# Altium schematic sheet ETH_PHY_RGMII.SchDoc: Sayma AMC
size 420 x 297 mm; $$Internal___BlkDate: 0:12:25_2-9-18; $$Internal_NAME_PLACEHOLDER: a3sheet; $$Internal_Resolution: 00001mm; $$NotCommonProperty_@NAME: ETH_PHY_RMII_MII; $$NotCommonProperty_@PRINTORDER: 6; $$NotCommonProperty_@SHEET: 1; $$NotCommonProperty_@SHEETTOTAL: 30; CmpIndex: 106; Drawing Author: G.Kasprowicz; Drawing Number: Sayma AMC; Drawing Project: AMC FMC Carrier Board; Drawing Revision: 2.0; SymIndex: 2141; CheckedBy: P.Kulik,T.Przywozki,W.Ruclo; Author: G.Kasprowicz; CompanyName: WUT ISE; DrawnBy: G.Kasprowicz; Organization: WUT ISE; Address1: PW ISE; Address2: Nowowiejska 15/19 00-665 Warsaw; Address3: gkasprow@gmail.com; DocumentNumber: 8; Revision: 2; SheetNumber: 8; SheetTotal: 32; ModifiedBy: -; CheckedDate: -; Title2: Ethernet PHY; DivGrp: WUT ISE; Designer: G.Kasprowicz; ModifiedDate: -; ProjectName: Sensor Box
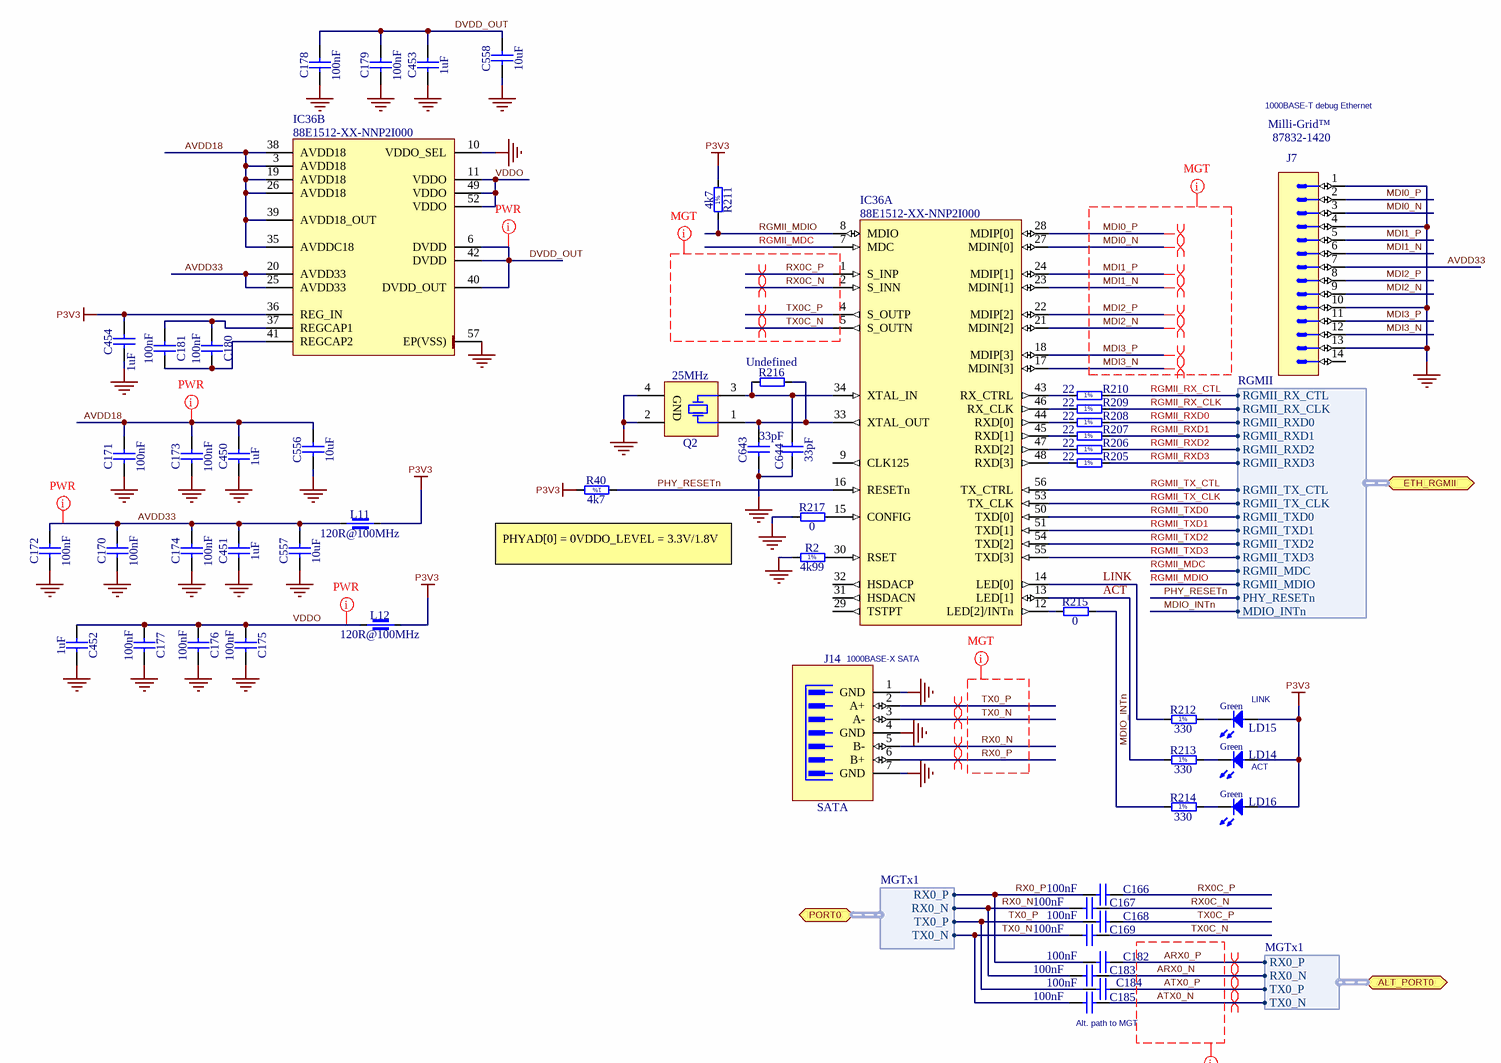
[diagram p0: ETH_PHY_RGMII.SchDoc]

## Parts
C166  100nF  [CAPC0603X33N]
C167  100nF  [CAPC0603X33N]
C168  100nF  [CAPC0603X33N]
C169  100nF  [CAPC0603X33N]
C170  100nF  [CAPC0603X33N]
C171  100nF  [CAPC0603X33N]
C172  100nF  [CAPC0603X33N]
C173  100nF  [CAPC0603X33N]
C174  100nF  [CAPC0603X33N]
C175  100nF  [CAPC0603X33N]
C176  100nF  [CAPC0603X33N]
C177  100nF  [CAPC0603X33N]
C178  100nF  [CAPC0603X33N]
C179  100nF  [CAPC0603X33N]
C180  100nF  [CAPC0603X33N]
C181  100nF  [CAPC0603X33N]
C182  100nF  [CAPC0603X33N]
C183  100nF  [CAPC0603X33N]
C184  100nF  [CAPC0603X33N]
C185  100nF  [CAPC0603X33N]
C450  1uF  [CAPC1005X55N]
C451  1uF  [CAPC1005X55N]
C452  1uF  [CAPC1005X55N]
C453  1uF  [CAPC1005X55N]
C454  1uF  [CAPC1005X55N]
C556  10uF  [CAPC1608X87N]
C557  10uF  [CAPC1608X87N]
C558  10uF  [CAPC1608X87N]
C643  33pF  [CAPC1005X55N]
C644  33pF  [CAPC1005X55N]
IC36  88E1512-XX-NNP2I000  [QFN50P800X800X100-57N-S437]  (parts A,B of 2)
J7  Milli-Grid™  Manufacturer Part Number: 87832-1420  [MOLEX_87832-1420]
J14  SATA  [MOLEX_67800-5005]
L11  120R@100MHz  [INDC1005X55N]
L12  120R@100MHz  [INDC1005X55N]
LD14  Green  [LED_AVAGO_HSME-C120]
LD15  Green  [LED_AVAGO_HSME-C120]
LD16  Green  [LED_AVAGO_HSME-C120]
Q2  25MHz  [XTAL_TXC_8Y]
R2  4k99  [RESC1608X55N]
R40  4k7  [RESC1005X40N]
R205  22  [RESC1005X40N]
R206  22  [RESC1005X40N]
R207  22  [RESC1005X40N]
R208  22  [RESC1005X40N]
R209  22  [RESC1005X40N]
R210  22  [RESC1005X40N]
R211  4k7  [RESC1005X40N]
R212  330  [RESC1005X40N]
R213  330  [RESC1005X40N]
R214  330  [RESC1005X40N]
R215  0  [RESC1005X40N]
R216  Undefined  [RESC1005X40N]
R217  0  [RESC1005X40N]

## Ports
ALT_PORT0 (bidir, harness MGTx1), ETH_RGMII (bidir, harness RGMII), PORT0 (bidir, harness MGTx1)

## Harnesses
MGTx1: RX0_P, RX0_N, TX0_P, TX0_N
RGMII: RGMII_RX_CTL, RGMII_RX_CLK, RGMII_RXD0, RGMII_RXD1, RGMII_RXD2, RGMII_RXD3, RGMII_TX_CTL, RGMII_TX_CLK, RGMII_TXD0, RGMII_TXD1, RGMII_TXD2, RGMII_TXD3, RGMII_MDC, RGMII_MDIO, PHY_RESETn, MDIO_INTn

## Nets
GND: C170.1 C171.1 C172.1 C173.1 C174.1 C175.1 C176.1 C177.1 C178.1 C179.1 C450.1 C451.1 C452.1 C453.1 C454.1 C556.1 C557.1 C558.1 C643.1 C644.1 IC36.10(VDDO_SEL) IC36.57(EP(VSS)) J7.1 J7.4 J7.10 J7.13 J14.1(GND) J14.4(GND) J14.7(GND) Q2.2(GND) Q2.4(GND) R2.1 R217.1
P3V3: C454.2 IC36.36(REG_IN) L11.2 L12.1 LD14.2(A) LD15.2(A) LD16.2(A) R40.2 R211.2
ACT: IC36.13(LED[1]) R213.1
ARX0_N: C183.2 ; port ALT_PORT0.RX0_N
ARX0_P: C182.2 ; port ALT_PORT0.RX0_P
ATX0_N: C185.2 ; port ALT_PORT0.TX0_N
ATX0_P: C184.2 ; port ALT_PORT0.TX0_P
AVDD18: C171.2 C173.2 C450.2 C556.2 IC36.3(AVDD18) IC36.19(AVDD18) IC36.26(AVDD18) IC36.35(AVDDC18) IC36.38(AVDD18) IC36.39(AVDD18_OUT)
AVDD33: C170.2 C172.2 C174.2 C451.2 C557.2 IC36.20(AVDD33) IC36.25(AVDD33) J7.7 L11.1
DVDD_OUT: C178.2 C179.2 C453.2 C558.2 IC36.6(DVDD) IC36.40(DVDD_OUT) IC36.42(DVDD)
LINK: IC36.14(LED[0]) R212.1
MDI0_N: IC36.27(MDIN[0]) J7.3
MDI0_P: IC36.28(MDIP[0]) J7.2
MDI1_N: IC36.23(MDIN[1]) J7.6
MDI1_P: IC36.24(MDIP[1]) J7.5
MDI2_N: IC36.21(MDIN[2]) J7.9
MDI2_P: IC36.22(MDIP[2]) J7.8
MDI3_N: IC36.17(MDIN[3]) J7.12
MDI3_P: IC36.18(MDIP[3]) J7.11
MDIO_INTn: R214.1 R215.2 ; port ETH_RGMII.MDIO_INTn
PHY_RESETn: IC36.16(RESETn) R40.1 ; port ETH_RGMII.PHY_RESETn
RGMII_MDC: IC36.7(MDC) ; port ETH_RGMII.RGMII_MDC
RGMII_MDIO: IC36.8(MDIO) R211.1 ; port ETH_RGMII.RGMII_MDIO
RGMII_RX_CLK: R209.2 ; port ETH_RGMII.RGMII_RX_CLK
RGMII_RX_CTL: R210.2 ; port ETH_RGMII.RGMII_RX_CTL
RGMII_RXD0: R208.2 ; port ETH_RGMII.RGMII_RXD0
RGMII_RXD1: R207.2 ; port ETH_RGMII.RGMII_RXD1
RGMII_RXD2: R206.2 ; port ETH_RGMII.RGMII_RXD2
RGMII_RXD3: R205.2 ; port ETH_RGMII.RGMII_RXD3
RGMII_TX_CLK: IC36.53(TX_CLK) ; port ETH_RGMII.RGMII_TX_CLK
RGMII_TX_CTL: IC36.56(TX_CTRL) ; port ETH_RGMII.RGMII_TX_CTL
RGMII_TXD0: IC36.50(TXD[0]) ; port ETH_RGMII.RGMII_TXD0
RGMII_TXD1: IC36.51(TXD[1]) ; port ETH_RGMII.RGMII_TXD1
RGMII_TXD2: IC36.54(TXD[2]) ; port ETH_RGMII.RGMII_TXD2
RGMII_TXD3: IC36.55(TXD[3]) ; port ETH_RGMII.RGMII_TXD3
RX0_N: C167.1 C183.1 J14.5(B-) ; port PORT0.RX0_N
RX0_P: C166.1 C182.1 J14.6(B+) ; port PORT0.RX0_P
RX0C_N: C167.2 IC36.2(S_INN)
RX0C_P: C166.2 IC36.1(S_INP)
TX0_N: C169.1 C185.1 J14.3(A-) ; port PORT0.TX0_N
TX0_P: C168.1 C184.1 J14.2(A+) ; port PORT0.TX0_P
TX0C_N: C169.2 IC36.5(S_OUTN)
TX0C_P: C168.2 IC36.4(S_OUTP)
VDDO: C175.2 C176.2 C177.2 C452.2 IC36.11(VDDO) IC36.49(VDDO) IC36.52(VDDO) L12.2
NetC180_1: C180.1 C181.1 IC36.41(REGCAP2)
NetC180_2: C180.2 C181.2 IC36.37(REGCAP1)
NetC643_2: C643.2 IC36.33(XTAL_OUT) Q2.1(X) R216.2
NetC644_2: C644.2 IC36.34(XTAL_IN) Q2.3(X) R216.1
NetIC36_12: IC36.12(LED[2]/INTn) R215.1
NetIC36_15: IC36.15(CONFIG) R217.2
NetIC36_30: IC36.30(RSET) R2.2
NetIC36_43: IC36.43(RX_CTRL) R210.1
NetIC36_44: IC36.44(RXD[0]) R208.1
NetIC36_45: IC36.45(RXD[1]) R207.1
NetIC36_46: IC36.46(RX_CLK) R209.1
NetIC36_47: IC36.47(RXD[2]) R206.1
NetIC36_48: IC36.48(RXD[3]) R205.1
NetLD14_1: LD14.1(C) R213.2
NetLD15_1: LD15.1(C) R212.2
NetLD16_1: LD16.1(C) R214.2

Not connected (* = marked no-connect by the designer): IC36 9(CLK125) 29(TSTPT) 31(HSDACN) 32(HSDACP); J7 14

## Layout directives
differential pair: ARX0_N, ARX0_P, ATX0_N, ATX0_P, MDI0_N, MDI0_P, MDI1_N, MDI1_P, MDI2_N, MDI2_P, MDI3_N, MDI3_P, RX0_N, RX0_P, RX0C_N, RX0C_P, TX0_N, TX0_P, TX0C_N, TX0C_P
net class PWR: AVDD18, AVDD33, DVDD_OUT, VDDO
net class MGT: ARX0_N, ARX0_P, ATX0_N, ATX0_P, MDI0_N, MDI0_P, MDI1_N, MDI1_P, MDI2_N, MDI2_P, MDI3_N, MDI3_P, RX0_N, RX0_P, RX0C_N, RX0C_P, TX0_N, TX0_P, TX0C_N, TX0C_P

## Notes on the sheet
- 1000BASE-T debug Ethernet
- (near R40) PHYAD[0] = 0VDDO_LEVEL = 3.3V/1.8V
- 1000BASE-X SATA
- (near LD15) LINK
- (near LD14) ACT
- (near C185) Alt. path to MGT
- Project/Equipment
- Document
- Designer
- Drawn by
- Check.by
- Copyright WUT ISE 2018.
  This documentation describes Open Hardware and is licensed under the CERN OHL v.1.1. You may redistribute and modify this documentation under the terms of the CERN OHL v.1.1. (http://ohwr.org/CERNOHL). This documentation is distributed WITHOUT ANY EXPRESS OR IMPLIED WARRANTY, INCLUDING OF MERCHANTABILITY, SATISFACTORY QUALITY AND FITNESS FOR A PARTICULAR PURPOSE. Please see the CERN OHL v.1.1 for applicable conditions.
- Contact
- File
- Last Mod.
- Print Date
- Sheet
- Size
- A3
- of
- Rev
- (in symbol R0402_4K7_1%_0.0625W_100PPM) 1%
- (in symbol R0402_22R_1%_0.0625W_100PPM) 1%
- (in symbol R0402_330R_1%_0.0625W_100PPM) 1%
- (in symbol R0603_4K99_1%_0.063W_50PPM) 1%

## Library data of the parts
C166-C185 = CC0201_100NF_6.3V_10%_X5R: Non-polarised capacitor; Manufacturer: GENERIC; Part Description: SMD Multilayer Chip Ceramic Capacitor; Manufacturer1 Part Number: 02016D104KAT2A; Tolerance: ±10%; Voltage: 6.3V; TC: X5R; Manufacturer Part Number: CC0201_100NF_6.3V_10%_X5R; Part Number: CC0201_100NF_6.3V_10%_X5R; Value: 100nF; Component Kind: Standard; Component Type: Standard; Pin Count: 2; Status: Not Recommended; Case: 0201; Mounted: Yes; Socket: No; SMD: Yes; Sense: No; Manufacturer1 Example: AVX; Manufacturer1 ComponentHeight: 0.33mm; HelpURL: \\cern.ch\dfs\Applications\Altium\Datasheets\CC0201_X5R_AVX.pdf; Author: CERN DEM JLC; CreateDate: 03.12.2007; LatestRevisionDate: 03.12.2007
C450-C454 = CC0402_1UF_16V_10%_X5R: Non-polarised capacitor; Manufacturer: GENERIC; Part Description: SMD Multilayer Chip Ceramic Capacitor; Manufacturer1 Part Number: C1005X5R1C105KT; Tolerance: ±10%; Voltage: 16V; TC: X5R; Manufacturer Part Number: CC0402_1UF_16V_10%_X5R; Part Number: CC0402_1UF_16V_10%_X5R; Value: 1uF; Component Kind: Standard; Component Type: Standard; Pin Count: 2; Status: Preferred; Case: 0402; Mounted: Yes; Socket: No; SMD: Yes; Sense: No; Manufacturer1 Example: TDK; Manufacturer1 ComponentHeight: 0.55mm; HelpURL: \\cern.ch\dfs\Applications\Altium\Datasheets\CC0402_X5R_TDK_C.pdf; Author: CERN DEM JLC; CreateDate: 25.10.2012; LatestRevisionDate: 25.10.2012
C556-C558 = CC0603_10UF_6.3V_20%_X5R: Non-polarised capacitor; Manufacturer: GENERIC; Part Description: SMD Multilayer Chip Ceramic Capacitor; Manufacturer1 Part Number: C0603C106M9PAC; Tolerance: ±20%; Voltage: 6.3V; TC: X5R; Manufacturer Part Number: CC0603_10uF_6.3V_20%_X5R; Part Number: CC0603_10UF_6.3V_20%_X5R; Value: 10uF; Component Kind: Standard; Component Type: Standard; Pin Count: 2; Status: Preferred; Case: 0603; Mounted: Yes; Socket: No; SMD: Yes; Sense: No; Manufacturer1 Example: KEMET; Manufacturer1 ComponentHeight: 0.95mm; HelpURL: \\cern.ch\dfs\Applications\Altium\Datasheets\CC0603_X5R_KEMET.pdf; Author: CERN DEM JLC; CreateDate: 03.12.2007; LatestRevisionDate: 03.12.2007
C643 C644 = CC0402_33PF_50V_5%_C0G: Non-polarised capacitor; Manufacturer: GENERIC; Part Description: SMD Multilayer Chip Ceramic Capacitor; Manufacturer1 Part Number: C0402C330J5GACTU; Tolerance: ±5%; Voltage: 50V; TC: C0G/NP0; Manufacturer Part Number: CC0402_33PF_50V_5%_C0G; Part Number: CC0402_33PF_50V_5%_C0G; Value: 33pF; Component Kind: Standard; Component Type: Standard; Pin Count: 2; Status: Preferred; Case: 0402; Mounted: Yes; Socket: No; SMD: Yes; Sense: No; Manufacturer1 Example: KEMET; Manufacturer1 ComponentHeight: 0.55mm; HelpURL: \\cern.ch\dfs\Applications\Altium\Datasheets\CC0805_C0G_KEMET_(Commercial Grade).pdf; Author: CERN DEM JLC; CreateDate: 03.12.2007; LatestRevisionDate: 22.04.2015
IC36 = 88E1512-XX-NNP2I000: Alaska Integrated 10/100/1000 Mbps Energy Efficient Ethernet Transceiver; Manufacturer: MARVELL  TECHNOLOGY; PressFit: No; Bonding: No; Manufacturer Part Number: 88E1512-XX-NNP2I000; PackageDescription: QFN, 0.50mm Pitch, Square; 56 Pin, 8.00mm L X 8.00mm W X 1.00mm H Body (4.37mm X 4.37mm Thermal Tab), IPC Medium Density; Part Description: Alaska Integrated 10/100/1000 Mbps Energy Efficient Ethernet Transceiver; Part Number: 88E1512-XX-NNP2I000; Component Kind: Standard; Component Type: Standard; Device: 88E1512-XX-NNP2I000; Pin Count: 57; Case: QFN56; Mounted: Yes; Socket: No; SMD: Yes; Sense: No; ComponentHeight: 1mm; Author: CERN DEM JLC; HelpURL: \\cern.ch\dfs\Applications\Altium\Datasheets\88E1512-XX-NNP2I000.pdf; CreateDate: 21.01.2015; LatestRevisionDate: 21.01.2015
J7 = MOLEX_87832-1420: Connector 14 Male; Manufacturer: MOLEX; Part Description: 2.00mm (.079") Pitch Milli-Grid™ Header, Surface Mount, Vertical, Shrouded, 14 Circuits,with Locking Windows and Centre Polarization Slot, PCB Locator; PressFit: No; Part Number: MOLEX_87832-1420; Component Kind: Standard; Component Type: Standard; Pin Count: 14; Family: Milli-Grid™; Mounted: Yes; Socket: No; SMD: Yes; Sense: No; Status: None; ComponentHeight: 7.6mm; HelpURL: \\cern.ch\dfs\Applications\Altium\Datasheets\MOLEX_87832-1420.pdf; Author: CERN DEM JLC; CreateDate: 09.09.2008; LatestRevisionDate: 09.09.2008
J14 = MOLEX_67800-5005: 7 Pin SATA Receptacle; Part Description: 1.27mm Pitch, 7 Contacts, Serial ATA High Speed Header, Straight with Locking Latch; Manufacturer: MOLEX; PressFit: No; Part Number: MOLEX_67800-5005; Component Kind: Standard; Component Type: Standard; Pin Count: 7; Family: SATA; Mounted: Yes; Socket: No; SMD: Yes; Sense: No; Status: None; Manufacturer Part Number: 67800-5005; ComponentHeight: 8.4mm; HelpURL: \\cern.ch\dfs\Applications\Altium\Datasheets\MOLEX_67800-5005.pdf; Author: CERN DEM MR; CreateDate: 01.12.2016; LatestRevisionDate: 01.12.2016
L11 L12 = IND0402_MURATA_BLM15PX121SN1D: Manufacturer: MURATA; Part Description: SMD EMIFIL Chip Ferrite Bead; Tolerance: ±25%; Power: 2A; Resistance: 0.055R; Manufacturer Part Number: BLM15PX121SN1D; Part Number: IND0402_MURATA_BLM15PX121SN1D; Value: 120R@100MHz; Component Kind: Standard; Component Type: Standard; Pin Count: 2; Status: None; Case: 0402; Mounted: Yes; Socket: No; SMD: Yes; Sense: No; ComponentHeight: 0.55mm; HelpURL: \\cern.ch\dfs\Applications\Altium\Datasheets\IND0402_MURATA_BLM15PX.pdf; Author: CERN DEM JMW; CreateDate: 19.02.2014; LatestRevisionDate: 25.10.2018
LD14-LD16 = LED_AVAGO_HSME-C120: LED Green 1C 2A; Manufacturer: AVAGO TECHNOLOGIES; Part Description: High Performance Right Angle Chip Green LED; PressFit: No; Bonding: No; Manufacturer Part Number: HSME-C120; PackageDescription: Green Chip LED, 2-Leads, Body 1.7x1.1mm, Side Emitting Package; Part Number: LED_AVAGO_HSME-C120; Component Kind: Standard; Component Type: Standard; Color: Green; Pin Count: 2; Mounted: Yes; Socket: No; SMD: Yes; Sense: No; ComponentHeight: 0.7mm; HelpURL: \\cern.ch\dfs\Applications\Altium\Datasheets\LED_AVAGO_HSME-C120.pdf; ComponentLink1URL: \\cern.ch\dfs\Applications\Altium\Datasheets\LED_AVAGO_HSME-C110_DESIGN-GUIDE.pdf; ComponentLink1Description: Design Guide; Author: CERN DEM JMW; CreateDate: 22.07.2009; LatestRevisionDate: 20.06.2012
Q2 = XTAL_25MHZ_TXC_8Y-25.000MAAJ-T: Crystal 4 pins 1=XTAL Control 2=GND3=XTAL 4=GND; Manufacturer: TXC CORPORATION; Part Description: ±30ppm 18pF -20°C to +70°C  4 Pins, 2x1.6X0.5mm, SMD Seam Sealing Crystal, 8Y Serie; PressFit: No; Bonding: No; Manufacturer Part Number: 8Y-25.000MAAJ-T; PackageDescription: 4 Pins, 2x1.6X0.5mm, SMD Seam Sealing Crystal, 8Y Serie; Part Number: XTAL_25MHZ_TXC_8Y-25.000MAAJ-T; Value: 25MHz; Component Kind: Standard; Component Type: Standard; Pin Count: 4; Mounted: Yes; Socket: No; SMD: Yes; Sense: No; ComponentHeight: 13.6mm; HelpURL: \\cern.ch\dfs\Applications\Altium\Datasheets\XTAL_TXC_8Y.pdf; Author: CERN DEM JLC; CreateDate: 08.03.2012; LatestRevisionDate: 08.03.2012
R2 = R0603_4K99_1%_0.063W_50PPM: Resistor - 1%; Manufacturer: GENERIC; Part Description: General Purpose Thick Film Chip Resistor; Manufacturer1 Part Number: CPF0603F4K99C1; Power: 0.1W; TC: ±50ppm/°C; PressFit: No; Manufacturer Part Number: R0603_4K99_1%_0.063W_50PPM; Part Number: R0603_4K99_1%_0.063W_50PPM; Tolerance: ±1%; Value: 4k99; Component Kind: Standard; Component Type: Standard; Pin Count: 2; Status: None; Case: 0603; Mounted: Yes; Sense: No; Socket: No; SMD: Yes; Manufacturer1 Example: TYCO NEOHM; Manufacturer1 ComponentHeight: 0.55mm; HelpURL: \\cern.ch\dfs\Applications\Altium\Datasheets\R0603_TYCO_CPF.pdf; Author: CERN DEM JLC; CreateDate: 20.05.2010; LatestRevisionDate: 20.05.2010
R40 R211 = R0402_4K7_1%_0.0625W_100PPM: Resistor - 1%; Manufacturer: GENERIC; Part Description: General Purpose Thick Film Chip Resistor; Manufacturer1 Part Number: 232270674702L; TC: ±100ppm/°C; PressFit: No; Manufacturer Part Number: R0402_4K7_1%_0.0625W_100PPM; Part Number: R0402_4K7_1%_0.0625W_100PPM; Tolerance: ±1%; Value: 4k7; Component Kind: Standard; Component Type: Standard; Pin Count: 2; Status: Not Recommended; Power: 0.0625W; Case: 0402; Mounted: Yes; Sense: No; Socket: No; SMD: Yes; Manufacturer1 Example: YAGEO PHYCOMP; Manufacturer1 ComponentHeight: 0.4mm; HelpURL: \\cern.ch\dfs\Applications\Altium\Datasheets\R0402_Phycomp_RC0402.pdf; Author: CERN DEM JLC; CreateDate: 03.12.2007; LatestRevisionDate: 17.10.2012
R205-R210 = R0402_22R_1%_0.0625W_100PPM: Resistor - 1%; Manufacturer: GENERIC; Part Description: General Purpose Thick Film Chip Resistor; Manufacturer1 Part Number: 232270672209L; TC: ±100ppm/°C; PressFit: No; Manufacturer Part Number: R0402_22R_1%_0.0625W_100PPM; Part Number: R0402_22R_1%_0.0625W_100PPM; Tolerance: ±1%; Value: 22; Component Kind: Standard; Component Type: Standard; Pin Count: 2; Status: Not Recommended; Power: 0.0625W; Case: 0402; Mounted: Yes; Sense: No; Socket: No; SMD: Yes; Manufacturer1 Example: YAGEO PHYCOMP; Manufacturer1 ComponentHeight: 0.4mm; HelpURL: \\cern.ch\dfs\Applications\Altium\Datasheets\R0402_Phycomp_RC0402.pdf; Author: CERN DEM JLC; CreateDate: 03.12.2007; LatestRevisionDate: 17.10.2012
R212-R214 = R0402_330R_1%_0.0625W_100PPM: Resistor - 1%; Manufacturer: GENERIC; Part Description: General Purpose Thick Film Chip Resistor; Manufacturer1 Part Number: 232270673301L; TC: ±100ppm/°C; PressFit: No; Manufacturer Part Number: R0402_330R_1%_0.0625W_100PPM; Part Number: R0402_330R_1%_0.0625W_100PPM; Tolerance: ±1%; Value: 330; Component Kind: Standard; Component Type: Standard; Pin Count: 2; Status: Not Recommended; Power: 0.0625W; Case: 0402; Mounted: Yes; Sense: No; Socket: No; SMD: Yes; Manufacturer1 Example: YAGEO PHYCOMP; Manufacturer1 ComponentHeight: 0.4mm; HelpURL: \\cern.ch\dfs\Applications\Altium\Datasheets\R0402_Phycomp_RC0402.pdf; Author: CERN DEM JLC; CreateDate: 03.12.2007; LatestRevisionDate: 17.10.2012
R215 R217 = R0402_0R_JUMPER: Resistor; Manufacturer: GENERIC; Part Description: 1A (0.05R Max DC Resistance) Zero Ohm Jumper; Manufacturer1 Part Number: 232270591001L; PressFit: No; Manufacturer Part Number: R0402_0R_JUMPER; Part Number: R0402_0R_JUMPER; Value: 0; Component Kind: Standard; Component Type: Standard; Pin Count: 2; Status: Not Recommended; Case: 0402; Mounted: Yes; Sense: No; Socket: No; SMD: Yes; Manufacturer1 Example: YAGEO PHYCOMP; Manufacturer1 ComponentHeight: 0.4mm; HelpURL: \\cern.ch\dfs\Applications\Altium\Datasheets\R0402_Phycomp_RC0402.pdf; Author: CERN DEM JLC; CreateDate: 03.12.2007; LatestRevisionDate: 17.10.2012
R216 = R0402_NO-VALUE: Resistor; Part Description: Reserved Footprint For a 0402 (1005) Chip Resistor; PressFit: No; Mounted: No; Manufacturer Part Number: R0402_NO-VALUE; Manufacturer: Undefined; Part Number: R0402_NO-VALUE; Value: Undefined; Component Kind: Standard; Component Type: Standard; Pin Count: 2; Status: None; Case: 0402; Sense: No; Socket: No; SMD: Yes; Manufacturer1 Example: Undefined; Manufacturer1 Part Number: Undefined; Manufacturer1 ComponentHeight: Undefined; HelpURL: Undefined; Author: CERN DEM JLC; CreateDate: 03.12.2007; LatestRevisionDate: 13.03.2008